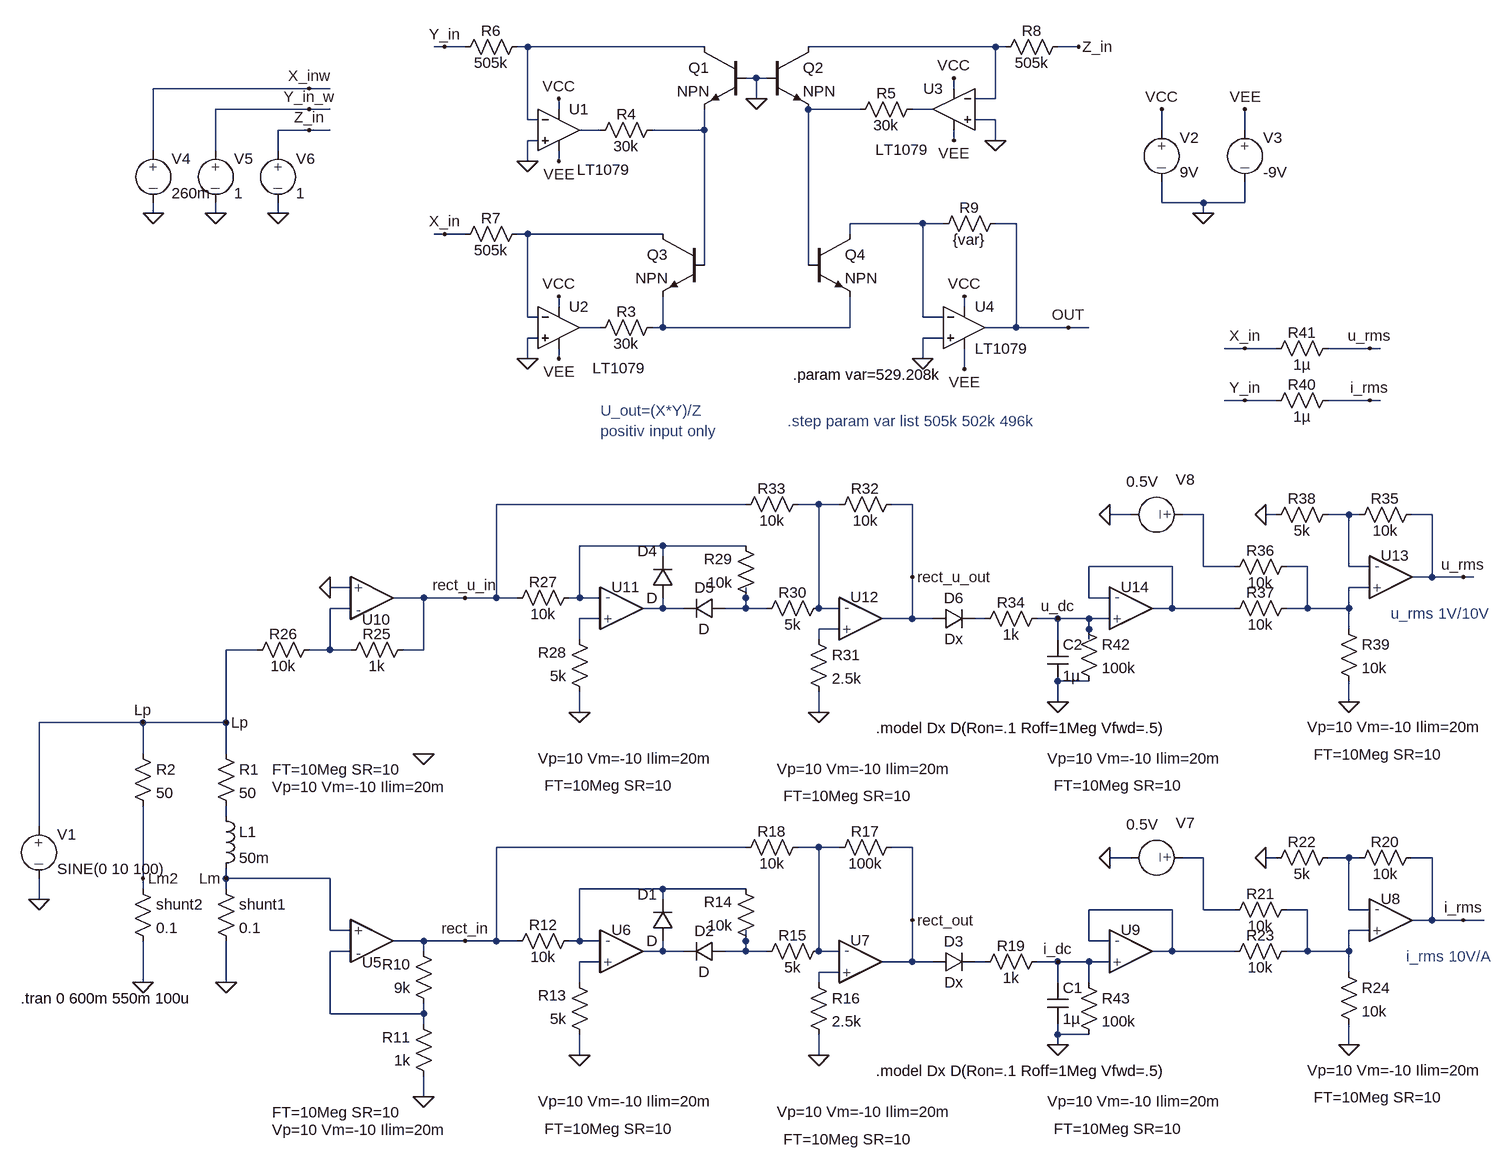
[diagram p0: schematic Blindleistungsmessung.asc]
Blindleistungsmessung.asc, the LTspice schematic file:
Version 4
SHEET 1 880 1172
WIRE -1264 -544 -1280 -544
WIRE -1232 -544 -1264 -544
WIRE -1136 -544 -1152 -544
WIRE -864 -544 -1136 -544
WIRE -416 -544 -704 -544
WIRE -400 -544 -416 -544
WIRE -288 -544 -320 -544
WIRE -784 -496 -800 -496
WIRE -768 -496 -784 -496
WIRE -1472 -480 -1712 -480
WIRE -1440 -480 -1472 -480
WIRE -480 -480 -480 -496
WIRE -784 -464 -784 -496
WIRE -416 -464 -416 -544
WIRE -416 -464 -448 -464
WIRE -1472 -448 -1616 -448
WIRE -1440 -448 -1472 -448
WIRE -1088 -448 -1088 -464
WIRE -624 -448 -704 -448
WIRE -512 -448 -544 -448
WIRE -1136 -432 -1136 -544
WIRE -1120 -432 -1136 -432
WIRE -416 -432 -448 -432
WIRE -1472 -416 -1520 -416
WIRE -1440 -416 -1472 -416
WIRE -1024 -416 -1056 -416
WIRE -864 -416 -864 -448
WIRE -864 -416 -944 -416
WIRE -160 -416 -160 -448
WIRE -32 -416 -32 -448
WIRE -1120 -400 -1136 -400
WIRE -480 -400 -480 -416
WIRE -416 -400 -416 -432
WIRE -1712 -384 -1712 -480
WIRE -1616 -384 -1616 -448
WIRE -1520 -384 -1520 -416
WIRE -1136 -368 -1136 -400
WIRE -1088 -368 -1088 -384
WIRE -160 -304 -160 -336
WIRE -96 -304 -160 -304
WIRE -32 -304 -32 -336
WIRE -32 -304 -96 -304
WIRE -1712 -288 -1712 -304
WIRE -1616 -288 -1616 -304
WIRE -1520 -288 -1520 -304
WIRE -96 -288 -96 -304
WIRE -528 -272 -640 -272
WIRE -496 -272 -528 -272
WIRE -384 -272 -416 -272
WIRE -1264 -256 -1280 -256
WIRE -1232 -256 -1264 -256
WIRE -1136 -256 -1152 -256
WIRE -928 -256 -1136 -256
WIRE -640 -256 -640 -272
WIRE -864 -208 -864 -416
WIRE -704 -208 -704 -448
WIRE -1088 -144 -1088 -160
WIRE -464 -144 -464 -160
WIRE -1136 -128 -1136 -256
WIRE -1120 -128 -1136 -128
WIRE -528 -128 -528 -272
WIRE -496 -128 -528 -128
WIRE -1024 -112 -1056 -112
WIRE -928 -112 -928 -160
WIRE -928 -112 -944 -112
WIRE -640 -112 -640 -160
WIRE -640 -112 -928 -112
WIRE -384 -112 -384 -272
WIRE -384 -112 -432 -112
WIRE -304 -112 -384 -112
WIRE -272 -112 -304 -112
WIRE -1120 -96 -1136 -96
WIRE -496 -96 -528 -96
WIRE -32 -80 -64 -80
WIRE 16 -80 -32 -80
WIRE 160 -80 96 -80
WIRE 176 -80 160 -80
WIRE -1136 -64 -1136 -96
WIRE -1088 -64 -1088 -80
WIRE -528 -64 -528 -96
WIRE -464 -48 -464 -80
WIRE -32 0 -64 0
WIRE 16 0 -32 0
WIRE 160 0 96 0
WIRE 176 0 160 0
WIRE -800 160 -1184 160
WIRE -688 160 -720 160
WIRE -656 160 -688 160
WIRE -544 160 -576 160
WIRE -208 176 -240 176
WIRE -96 176 -128 176
WIRE 16 176 0 176
WIRE 128 176 96 176
WIRE 144 176 128 176
WIRE 256 176 224 176
WIRE -928 224 -1056 224
WIRE -800 224 -928 224
WIRE -928 240 -928 224
WIRE -144 256 -272 256
WIRE -96 256 -96 176
WIRE -48 256 -96 256
WIRE 64 256 32 256
WIRE 128 256 128 176
WIRE 160 256 128 256
WIRE -544 272 -544 160
WIRE 256 272 256 176
WIRE 256 272 224 272
WIRE 304 272 256 272
WIRE 320 272 304 272
WIRE -1408 288 -1440 288
WIRE 160 288 128 288
WIRE -1296 304 -1344 304
WIRE -1232 304 -1296 304
WIRE -1184 304 -1184 160
WIRE -1184 304 -1232 304
WIRE -1152 304 -1184 304
WIRE -1056 304 -1056 224
WIRE -1056 304 -1072 304
WIRE -1024 304 -1056 304
WIRE -800 304 -800 288
WIRE -272 304 -272 256
WIRE -240 304 -272 304
WIRE -1408 320 -1440 320
WIRE -928 320 -928 304
WIRE -928 320 -960 320
WIRE -896 320 -928 320
WIRE -800 320 -800 304
WIRE -800 320 -832 320
WIRE -768 320 -800 320
WIRE -688 320 -688 160
WIRE -656 320 -688 320
WIRE -144 320 -144 256
WIRE -144 320 -176 320
WIRE -48 320 -144 320
WIRE 64 320 64 256
WIRE 64 320 32 320
WIRE 128 320 128 288
WIRE 128 320 64 320
WIRE -1024 336 -1056 336
WIRE -544 336 -544 272
WIRE -544 336 -592 336
WIRE -512 336 -544 336
WIRE -432 336 -448 336
WIRE -320 336 -352 336
WIRE -272 336 -320 336
WIRE -240 336 -272 336
WIRE -656 352 -688 352
WIRE -272 352 -272 336
WIRE 128 352 128 320
WIRE -1056 368 -1056 336
WIRE -688 368 -688 352
WIRE -320 368 -320 336
WIRE -272 368 -272 352
WIRE -1552 384 -1600 384
WIRE -1440 384 -1440 320
WIRE -1440 384 -1472 384
WIRE -1408 384 -1440 384
WIRE -1296 384 -1296 304
WIRE -1296 384 -1328 384
WIRE -272 432 -320 432
WIRE -320 464 -320 432
WIRE 128 464 128 432
WIRE -1056 480 -1056 448
WIRE -688 480 -688 448
WIRE -1728 496 -1888 496
WIRE -1600 496 -1600 384
WIRE -1600 496 -1728 496
WIRE -1728 544 -1728 496
WIRE -1600 544 -1600 496
WIRE -1600 640 -1600 624
WIRE -1888 656 -1888 496
WIRE -800 688 -1184 688
WIRE -688 688 -720 688
WIRE -656 688 -688 688
WIRE -544 688 -576 688
WIRE -208 704 -240 704
WIRE -96 704 -128 704
WIRE 16 704 0 704
WIRE 128 704 96 704
WIRE 144 704 128 704
WIRE 256 704 224 704
WIRE -1728 736 -1728 624
WIRE -1600 736 -1600 720
WIRE -1440 736 -1600 736
WIRE -1728 752 -1728 736
WIRE -1600 752 -1600 736
WIRE -928 752 -1056 752
WIRE -800 752 -928 752
WIRE -1888 768 -1888 736
WIRE -928 768 -928 752
WIRE -144 784 -272 784
WIRE -96 784 -96 704
WIRE -48 784 -96 784
WIRE 64 784 32 784
WIRE 128 784 128 704
WIRE 160 784 128 784
WIRE -544 800 -544 688
WIRE 256 800 256 704
WIRE 256 800 224 800
WIRE 304 800 256 800
WIRE 336 800 304 800
WIRE -1440 816 -1440 736
WIRE -1408 816 -1440 816
WIRE 160 816 128 816
WIRE -1296 832 -1344 832
WIRE -1232 832 -1296 832
WIRE -1184 832 -1184 688
WIRE -1184 832 -1232 832
WIRE -1152 832 -1184 832
WIRE -1056 832 -1056 752
WIRE -1056 832 -1072 832
WIRE -1024 832 -1056 832
WIRE -800 832 -800 816
WIRE -272 832 -272 784
WIRE -240 832 -272 832
WIRE -1408 848 -1440 848
WIRE -1296 848 -1296 832
WIRE -928 848 -928 832
WIRE -928 848 -960 848
WIRE -896 848 -928 848
WIRE -800 848 -800 832
WIRE -800 848 -832 848
WIRE -768 848 -800 848
WIRE -688 848 -688 688
WIRE -656 848 -688 848
WIRE -144 848 -144 784
WIRE -144 848 -176 848
WIRE -48 848 -144 848
WIRE 64 848 64 784
WIRE 64 848 32 848
WIRE 128 848 128 816
WIRE 128 848 64 848
WIRE -1024 864 -1056 864
WIRE -544 864 -544 800
WIRE -544 864 -592 864
WIRE -512 864 -544 864
WIRE -432 864 -448 864
WIRE -320 864 -352 864
WIRE -272 864 -320 864
WIRE -240 864 -272 864
WIRE -656 880 -688 880
WIRE 128 880 128 848
WIRE -1728 896 -1728 832
WIRE -1600 896 -1600 832
WIRE -1056 896 -1056 864
WIRE -688 896 -688 880
WIRE -320 896 -320 864
WIRE -272 896 -272 864
WIRE -1440 944 -1440 848
WIRE -1296 944 -1296 928
WIRE -1296 944 -1440 944
WIRE -1296 960 -1296 944
WIRE -320 976 -320 960
WIRE -272 976 -320 976
WIRE -320 992 -320 976
WIRE 128 992 128 960
WIRE -1056 1008 -1056 976
WIRE -688 1008 -688 976
WIRE -1296 1072 -1296 1040
FLAG -1888 768 0
FLAG -1600 896 0
FLAG -1600 496 Lp
FLAG -1600 736 Lm
FLAG -1728 896 0
FLAG -1728 496 Lp
FLAG -1728 736 Lm2
FLAG -784 -464 0
FLAG -96 -288 0
FLAG -1136 -64 0
FLAG -1136 -368 0
FLAG -528 -64 0
FLAG -416 -400 0
FLAG -160 -448 VCC
FLAG -480 -496 VCC
FLAG -464 -160 VCC
FLAG -1088 -160 VCC
FLAG -1088 -464 VCC
FLAG -1088 -368 VEE
FLAG -1088 -64 VEE
FLAG -480 -400 VEE
FLAG -464 -48 VEE
FLAG -304 -112 OUT
FLAG -1264 -544 Y_in
FLAG -288 -544 Z_in
FLAG -1264 -256 X_in
FLAG -1520 -288 0
FLAG -1616 -288 0
FLAG -1712 -288 0
FLAG -1472 -480 X_inw
FLAG -1472 -448 Y_in_w
FLAG -1472 -416 Z_in
FLAG -32 -448 VEE
FLAG -1296 1072 0
FLAG -1056 1008 0
FLAG -688 1008 0
FLAG -544 800 rect_out
FLAG -1232 832 rect_in
FLAG -320 992 0
FLAG -320 864 i_dc
FLAG -240 704 0
FLAG 0 704 0
FLAG 128 992 0
FLAG -1296 544 0
FLAG -1056 480 0
FLAG -688 480 0
FLAG -544 272 rect_u_out
FLAG -1232 304 rect_u_in
FLAG -320 464 0
FLAG -320 336 u_dc
FLAG -240 176 0
FLAG 0 176 0
FLAG 128 464 0
FLAG -1440 288 0
FLAG 304 800 i_rms
FLAG 304 272 u_rms
FLAG 160 -80 u_rms
FLAG 160 0 i_rms
FLAG -32 -80 X_in
FLAG -32 0 Y_in
SYMBOL source-V -1888 640 R0
WINDOW 123 0 0 Left 0
WINDOW 39 0 0 Left 0
SYMATTR InstName V1
SYMATTR Value SINE(0 10 100)
SYMBOL res -1616 528 R0
SYMATTR InstName R1
SYMATTR Value 50
SYMBOL ind -1616 624 R0
SYMATTR InstName L1
SYMATTR Value 50m
SYMBOL res -1616 736 R0
SYMATTR InstName shunt1
SYMATTR Value 0.1
SYMBOL res -1744 528 R0
SYMATTR InstName R2
SYMATTR Value 50
SYMBOL res -1744 736 R0
SYMATTR InstName shunt2
SYMATTR Value 0.1
SYMBOL Opamps\\LT1079 -1088 -480 R0
WINDOW 3 28 125 Left 0
SYMATTR InstName U1
SYMBOL Opamps\\LT1079 -1088 -176 R0
WINDOW 3 52 126 Left 0
SYMATTR InstName U2
SYMBOL Opamps\\LT1079 -480 -512 M0
WINDOW 3 38 126 Left 0
SYMATTR InstName U3
SYMBOL Opamps\\LT1079 -464 -176 R0
SYMATTR InstName U4
SYMBOL EIT_Semiconductors\\npn -800 -544 M0
SYMATTR InstName Q1
SYMBOL EIT_Semiconductors\\npn -768 -544 R0
SYMATTR InstName Q2
SYMBOL EIT_Semiconductors\\npn -864 -256 M0
SYMATTR InstName Q3
SYMBOL EIT_Semiconductors\\npn -704 -256 R0
SYMATTR InstName Q4
SYMBOL res -1040 -96 R270
WINDOW 0 25 56 VTop 0
WINDOW 3 7 56 VBottom 0
SYMATTR InstName R3
SYMATTR Value 30k
SYMBOL res -1040 -400 R270
WINDOW 0 25 56 VTop 0
WINDOW 3 7 56 VBottom 0
SYMATTR InstName R4
SYMATTR Value 30k
SYMBOL res -640 -432 R270
WINDOW 0 25 56 VTop 0
WINDOW 3 7 56 VBottom 0
SYMATTR InstName R5
SYMATTR Value 30k
SYMBOL res -1136 -560 R90
WINDOW 0 7 56 VBottom 0
WINDOW 3 25 56 VTop 0
SYMATTR InstName R6
SYMATTR Value 505k
SYMBOL res -1136 -272 R90
WINDOW 0 7 56 VBottom 0
WINDOW 3 25 56 VTop 0
SYMATTR InstName R7
SYMATTR Value 505k
SYMBOL res -304 -560 R90
WINDOW 0 7 56 VBottom 0
WINDOW 3 25 56 VTop 0
SYMATTR InstName R8
SYMATTR Value 505k
SYMBOL res -400 -288 R90
WINDOW 0 7 56 VBottom 0
WINDOW 3 25 56 VTop 0
SYMATTR InstName R9
SYMATTR Value {var}
SYMBOL source-V -160 -432 R0
WINDOW 123 0 0 Left 0
WINDOW 39 0 0 Left 0
SYMATTR InstName V2
SYMATTR Value 9V
SYMBOL source-V -32 -432 R0
SYMATTR InstName V3
SYMATTR Value -9V
SYMBOL source-V -1712 -400 R0
WINDOW 123 0 0 Left 0
WINDOW 39 0 0 Left 0
SYMATTR InstName V4
SYMATTR Value 260m
SYMBOL source-V -1616 -400 R0
SYMATTR InstName V5
SYMATTR Value 1
SYMBOL source-V -1520 -400 R0
SYMATTR InstName V6
SYMATTR Value 1
SYMBOL EIT_Semiconductors\\op_3 -1376 832 M180
WINDOW 123 -153 -264 Left 0
WINDOW 3 -153 -291 Left 0
SYMATTR InstName U5
SYMBOL res -1280 944 R180
WINDOW 0 36 76 Left 0
WINDOW 3 36 40 Left 0
SYMATTR InstName R10
SYMATTR Value 9k
SYMBOL res -1280 1056 R180
WINDOW 0 36 76 Left 0
WINDOW 3 36 40 Left 0
SYMATTR InstName R11
SYMATTR Value 1k
SYMBOL EIT_Semiconductors\\op_3 -992 848 R0
WINDOW 123 -118 273 Left 0
WINDOW 3 -128 231 Left 0
SYMATTR InstName U6
SYMBOL res -1056 816 R90
WINDOW 0 7 56 VBottom 0
WINDOW 3 25 56 VTop 0
SYMATTR InstName R12
SYMATTR Value 10k
SYMBOL res -1040 992 R180
WINDOW 0 36 76 Left 0
WINDOW 3 36 40 Left 0
SYMATTR InstName R13
SYMATTR Value 5k
SYMBOL res -784 848 R180
WINDOW 0 36 76 Left 0
WINDOW 3 36 40 Left 0
SYMATTR InstName R14
SYMATTR Value 10k
SYMBOL diode -912 832 R180
WINDOW 0 24 72 Left 0
WINDOW 3 24 0 Left 0
SYMATTR InstName D1
SYMBOL diode -832 832 R90
WINDOW 0 0 32 VBottom 0
WINDOW 3 32 32 VTop 0
SYMATTR InstName D2
SYMBOL res -672 832 R90
WINDOW 0 7 56 VBottom 0
WINDOW 3 25 56 VTop 0
SYMATTR InstName R15
SYMATTR Value 5k
SYMBOL EIT_Semiconductors\\op_3 -624 864 R0
WINDOW 123 -118 273 Left 0
WINDOW 3 -128 231 Left 0
SYMATTR InstName U7
SYMBOL res -704 880 R0
SYMATTR InstName R16
SYMATTR Value 2.5k
SYMBOL res -560 672 R90
WINDOW 0 7 56 VBottom 0
WINDOW 3 25 56 VTop 0
SYMATTR InstName R17
SYMATTR Value 100k
SYMBOL res -704 672 R90
WINDOW 0 7 56 VBottom 0
WINDOW 3 25 56 VTop 0
SYMATTR InstName R18
SYMATTR Value 10k
SYMBOL cap -336 896 R0
SYMATTR InstName C1
SYMATTR Value 1µ
SYMBOL res -336 848 R90
WINDOW 0 7 56 VBottom 0
WINDOW 3 25 56 VTop 0
SYMATTR InstName R19
SYMATTR Value 1k
SYMBOL diode -512 880 R270
WINDOW 0 32 32 VTop 0
WINDOW 3 0 32 VBottom 0
SYMATTR InstName D3
SYMATTR Value Dx
SYMBOL EIT_Semiconductors\\op_3 192 800 R0
WINDOW 123 -118 273 Left 0
WINDOW 3 -128 231 Left 0
SYMATTR InstName U8
SYMBOL res 128 720 R270
WINDOW 0 25 56 VTop 0
WINDOW 3 7 56 VBottom 0
SYMATTR InstName R20
SYMATTR Value 10k
SYMBOL res -64 800 R270
WINDOW 0 25 56 VTop 0
WINDOW 3 7 56 VBottom 0
SYMATTR InstName R21
SYMATTR Value 10k
SYMBOL res -64 864 R270
WINDOW 0 25 56 VTop 0
WINDOW 3 7 56 VBottom 0
SYMATTR InstName R23
SYMATTR Value 10k
SYMBOL source-V -112 704 R90
WINDOW 0 -54 -3 VRight 0
WINDOW 3 -51 53 VRight 0
WINDOW 123 0 0 Left 0
WINDOW 39 0 0 Left 0
SYMATTR InstName V7
SYMATTR Value 0.5V
SYMBOL EIT_Semiconductors\\op_3 -208 848 R0
WINDOW 123 -118 273 Left 0
WINDOW 3 -128 231 Left 0
SYMATTR InstName U9
SYMBOL res 0 720 R270
WINDOW 0 25 56 VTop 0
WINDOW 3 7 56 VBottom 0
SYMATTR InstName R22
SYMATTR Value 5k
SYMBOL res 112 864 R0
SYMATTR InstName R24
SYMATTR Value 10k
SYMBOL EIT_Semiconductors\\op_3 -1376 304 M180
WINDOW 123 -153 -264 Left 0
WINDOW 3 -153 -291 Left 0
SYMATTR InstName U10
SYMBOL res -1312 368 R90
WINDOW 0 7 56 VBottom 0
WINDOW 3 25 56 VTop 0
SYMATTR InstName R25
SYMATTR Value 1k
SYMBOL res -1568 400 R270
WINDOW 0 25 56 VTop 0
WINDOW 3 7 56 VBottom 0
SYMATTR InstName R26
SYMATTR Value 10k
SYMBOL EIT_Semiconductors\\op_3 -992 320 R0
WINDOW 123 -118 273 Left 0
WINDOW 3 -128 231 Left 0
SYMATTR InstName U11
SYMBOL res -1056 288 R90
WINDOW 0 7 56 VBottom 0
WINDOW 3 25 56 VTop 0
SYMATTR InstName R27
SYMATTR Value 10k
SYMBOL res -1040 464 R180
WINDOW 0 36 76 Left 0
WINDOW 3 36 40 Left 0
SYMATTR InstName R28
SYMATTR Value 5k
SYMBOL res -784 320 R180
WINDOW 0 36 76 Left 0
WINDOW 3 36 40 Left 0
SYMATTR InstName R29
SYMATTR Value 10k
SYMBOL diode -912 304 R180
WINDOW 0 24 72 Left 0
WINDOW 3 24 0 Left 0
SYMATTR InstName D4
SYMBOL diode -832 304 R90
WINDOW 0 0 32 VBottom 0
WINDOW 3 32 32 VTop 0
SYMATTR InstName D5
SYMBOL res -672 304 R90
WINDOW 0 7 56 VBottom 0
WINDOW 3 25 56 VTop 0
SYMATTR InstName R30
SYMATTR Value 5k
SYMBOL EIT_Semiconductors\\op_3 -624 336 R0
WINDOW 123 -118 273 Left 0
WINDOW 3 -128 231 Left 0
SYMATTR InstName U12
SYMBOL res -704 352 R0
SYMATTR InstName R31
SYMATTR Value 2.5k
SYMBOL res -560 144 R90
WINDOW 0 7 56 VBottom 0
WINDOW 3 25 56 VTop 0
SYMATTR InstName R32
SYMATTR Value 10k
SYMBOL res -704 144 R90
WINDOW 0 7 56 VBottom 0
WINDOW 3 25 56 VTop 0
SYMATTR InstName R33
SYMATTR Value 10k
SYMBOL cap -336 368 R0
SYMATTR InstName C2
SYMATTR Value 1µ
SYMBOL res -336 320 R90
WINDOW 0 7 56 VBottom 0
WINDOW 3 25 56 VTop 0
SYMATTR InstName R34
SYMATTR Value 1k
SYMBOL diode -512 352 R270
WINDOW 0 32 32 VTop 0
WINDOW 3 0 32 VBottom 0
SYMATTR InstName D6
SYMATTR Value Dx
SYMBOL EIT_Semiconductors\\op_3 192 272 R0
WINDOW 123 -118 273 Left 0
WINDOW 3 -128 231 Left 0
SYMATTR InstName U13
SYMBOL res 128 192 R270
WINDOW 0 25 56 VTop 0
WINDOW 3 7 56 VBottom 0
SYMATTR InstName R35
SYMATTR Value 10k
SYMBOL res -64 272 R270
WINDOW 0 25 56 VTop 0
WINDOW 3 7 56 VBottom 0
SYMATTR InstName R36
SYMATTR Value 10k
SYMBOL res -64 336 R270
WINDOW 0 25 56 VTop 0
WINDOW 3 7 56 VBottom 0
SYMATTR InstName R37
SYMATTR Value 10k
SYMBOL source-V -112 176 R90
WINDOW 0 -54 -3 VRight 0
WINDOW 3 -51 53 VRight 0
WINDOW 123 0 0 Left 0
WINDOW 39 0 0 Left 0
SYMATTR InstName V8
SYMATTR Value 0.5V
SYMBOL EIT_Semiconductors\\op_3 -208 320 R0
WINDOW 123 -118 273 Left 0
WINDOW 3 -128 231 Left 0
SYMATTR InstName U14
SYMBOL res 0 192 R270
WINDOW 0 25 56 VTop 0
WINDOW 3 7 56 VBottom 0
SYMATTR InstName R38
SYMATTR Value 5k
SYMBOL res 112 336 R0
SYMATTR InstName R39
SYMATTR Value 10k
SYMBOL res 112 -16 R90
WINDOW 0 7 56 VBottom 0
WINDOW 3 25 56 VTop 0
SYMATTR InstName R40
SYMATTR Value 1µ
SYMBOL res 112 -96 R90
WINDOW 0 7 56 VBottom 0
WINDOW 3 25 56 VTop 0
SYMATTR InstName R41
SYMATTR Value 1µ
SYMBOL res -288 336 R0
SYMATTR InstName R42
SYMATTR Value 100k
SYMBOL res -288 880 R0
SYMATTR InstName R43
SYMATTR Value 100k
TEXT -1916 920 Left 0 !.tran 0 600m 550m 100u
TEXT -728 -40 Left 0 !.param var=529.208k
TEXT -1024 16 Left 0 ;U_out=(X*Y)/Z\npositiv input only
TEXT -736 32 Left 0 ;.step param var list 505k 502k 496k
TEXT -600 1032 Left 0 !.model Dx D(Ron=.1 Roff=1Meg Vfwd=.5)
TEXT -600 504 Left 0 !.model Dx D(Ron=.1 Roff=1Meg Vfwd=.5)
TEXT 216 856 Left 0 ;i_rms 10V/A
TEXT 192 328 Left 0 ;u_rms 1V/10V

The netlist it stands for:
* Blindleistungsmessung.asc
V1 Lp 0 SINE(0 10 100)
R1 Lp N023 50
L1 N023 Lm 50m
R§shunt1 Lm 0 0.1
R2 Lp Lm2 50
R§shunt2 Lm2 0 0.1
XU1 0 N001 VCC VEE N005 LT1079  ; pins In+ In- V+ V- OUT
XU2 0 N008 VCC VEE N009 LT1079  ; pins In+ In- V+ V- OUT
XU3 0 N002 VCC VEE N004 LT1079  ; pins In+ In- V+ V- OUT
XU4 0 N007 VCC VEE OUT LT1079  ; pins In+ In- V+ V- OUT
Q1 N001 0 N006 0 NPN
Q2 N002 0 N003 0 NPN
Q3 N008 N006 N010 0 NPN
Q4 N007 N003 N010 0 NPN
R3 N009 N010 30k
R4 N005 N006 30k
R5 N003 N004 30k
R6 N001 Y_in 505k
R7 N008 X_in 505k
R8 Z_in N002 505k
R9 OUT N007 {var}
V2 VCC 0 9V
V3 VEE 0 -9V
V4 X_inw 0 260m
V5 Y_in_w 0 1
V6 Z_in 0 1
XU5 Lm N031 rect_in opamp_param_3 Vp=10 Vm=-10 Ilim=20m FT=10Meg SR=10 Vos=0 A0=100k phir=45 en=0 enk=0 in=0 ink=0 Rin=500Meg  ; pins In+ In- OUT
R10 N031 rect_in 9k
R11 0 N031 1k
XU6 N033 N027 N032 opamp_param_3 Vp=10 Vm=-10 Ilim=20m FT=10Meg SR=10 Vos=0 A0=100k phir=45 en=0 enk=0 in=0 ink=0 Rin=500Meg  ; pins In+ In- OUT
R12 N027 rect_in 10k
R13 0 N033 5k
R14 N030 N027 10k
D1 N032 N027 D
D2 N030 N032 D
R15 N024 N030 5k
XU7 N035 N024 rect_out opamp_param_3 Vp=10 Vm=-10 Ilim=20m FT=10Meg SR=10 Vos=0 A0=100k phir=45 en=0 enk=0 in=0 ink=0 Rin=500Meg  ; pins In+ In- OUT
R16 N035 0 2.5k
R17 rect_out N024 100k
R18 N024 rect_in 10k
C1 i_dc 0 1µ
R19 i_dc N034 1k
D3 rect_out N034 Dx
XU8 N029 N026 i_rms opamp_param_3 Vp=10 Vm=-10 Ilim=20m FT=10Meg SR=10 Vos=0 A0=100k phir=45 en=0 enk=0 in=0 ink=0 Rin=500Meg  ; pins In+ In- OUT
R20 N026 i_rms 10k
R21 N025 N029 10k
R23 N028 N029 10k
V7 N025 0 0.5V
XU9 i_dc N028 N028 opamp_param_3 Vp=10 Vm=-10 Ilim=20m FT=10Meg SR=10 Vos=0 A0=100k phir=45 en=0 enk=0 in=0 ink=0 Rin=500Meg  ; pins In+ In- OUT
R22 0 N026 5k
R24 N029 0 10k
XU10 0 N018 rect_u_in opamp_param_3 Vp=10 Vm=-10 Ilim=20m FT=10Meg SR=10 Vos=0 A0=100k phir=45 en=0 enk=0 in=0 ink=0 Rin=500Meg  ; pins In+ In- OUT
R25 rect_u_in N018 1k
R26 Lp N018 10k
XU11 N020 N014 N019 opamp_param_3 Vp=10 Vm=-10 Ilim=20m FT=10Meg SR=10 Vos=0 A0=100k phir=45 en=0 enk=0 in=0 ink=0 Rin=500Meg  ; pins In+ In- OUT
R27 N014 rect_u_in 10k
R28 0 N020 5k
R29 N017 N014 10k
D4 N019 N014 D
D5 N017 N019 D
R30 N011 N017 5k
XU12 N022 N011 rect_u_out opamp_param_3 Vp=10 Vm=-10 Ilim=20m FT=10Meg SR=10 Vos=0 A0=100k phir=45 en=0 enk=0 in=0 ink=0 Rin=500Meg  ; pins In+ In- OUT
R31 N022 0 2.5k
R32 rect_u_out N011 10k
R33 N011 rect_u_in 10k
C2 u_dc 0 1µ
R34 u_dc N021 1k
D6 rect_u_out N021 Dx
XU13 N016 N013 u_rms opamp_param_3 Vp=10 Vm=-10 Ilim=20m FT=10Meg SR=10 Vos=0 A0=100k phir=45 en=0 enk=0 in=0 ink=0 Rin=500Meg  ; pins In+ In- OUT
R35 N013 u_rms 10k
R36 N012 N016 10k
R37 N015 N016 10k
V8 N012 0 0.5V
XU14 u_dc N015 N015 opamp_param_3 Vp=10 Vm=-10 Ilim=20m FT=10Meg SR=10 Vos=0 A0=100k phir=45 en=0 enk=0 in=0 ink=0 Rin=500Meg  ; pins In+ In- OUT
R38 0 N013 5k
R39 N016 0 10k
R40 i_rms Y_in 1µ
R41 u_rms X_in 1µ
R42 u_dc 0 100k
R43 i_dc 0 100k
.model D D
.lib standard.dio
.model NPN NPN
.model PNP PNP
.lib standard.bjt
.tran 0 600m 550m 100u
.param var=529.208k
* U_out=(X*Y)/Z
* positiv input only
* .step param var list 505k 502k 496k
.model Dx D(Ron=.1 Roff=1Meg Vfwd=.5)
.model Dx D(Ron=.1 Roff=1Meg Vfwd=.5)
* i_rms 10V/A
* u_rms 1V/10V
.lib EIT_sub\opamp_parametrierbar.sub
.backanno
.end